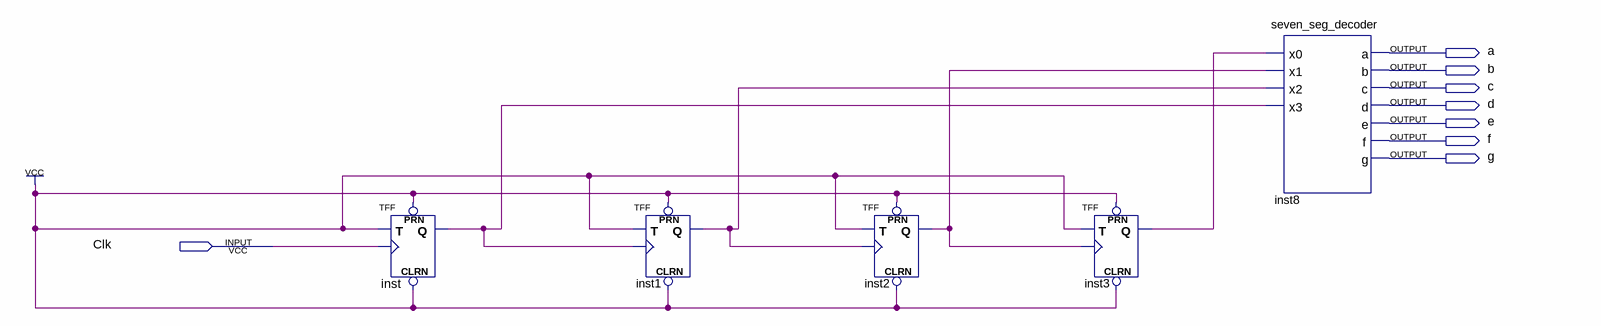
[diagram p0: schematic sheet]
// Quartus schematic lab10step3a.bdf as structural Verilog: 5 symbols, 8 pins
module lab10step3a (
  input  Clk,
  output a,
  output b,
  output c,
  output d,
  output e,
  output f,
  output g
);

  wire inst1_q, inst2_q, inst3_q, inst_q;

  TFF inst (.PRN(1'b1), .CLRN(1'b1), .T(1'b1), .CLK(Clk), .Q(inst_q));
  TFF inst1 (.PRN(1'b1), .CLRN(1'b1), .T(1'b1), .CLK(inst_q), .Q(inst1_q));
  TFF inst2 (.PRN(1'b1), .CLRN(1'b1), .T(1'b1), .CLK(inst1_q), .Q(inst2_q));
  TFF inst3 (.PRN(1'b1), .CLRN(1'b1), .T(1'b1), .CLK(inst2_q), .Q(inst3_q));
  seven_seg_decoder inst8 (
    .x0(inst3_q), .x1(inst2_q), .x2(inst1_q), .x3(inst_q), .a(a), .b(b), .c(c), .d(d), .e(e), .f(f), .g(g));
endmodule
